# Altium schematic sheet al115v20_power.SchDoc
size A4; DrawnBy: Suraj K A; Engineer: Suraj K A; Organization: Simcons Control Systems; Address1: HMT Colony PO; Address2: Kalamassery; Address3: Cochin; Address4: India
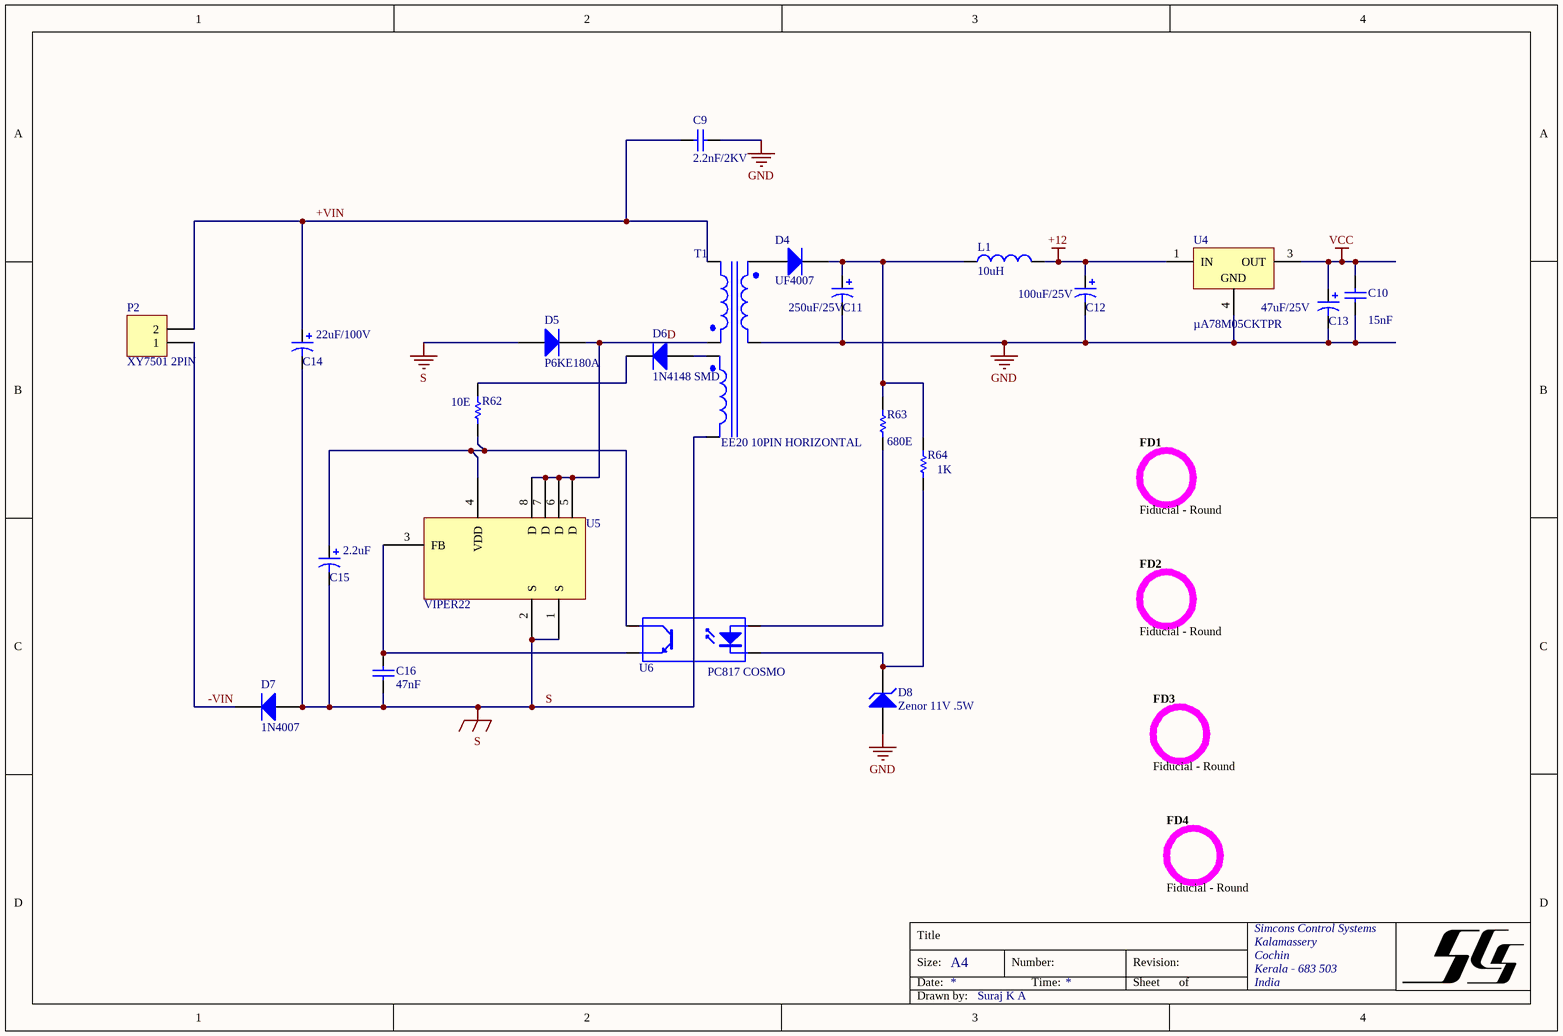
[diagram p0: al115v20_power.SchDoc]

## Parts
C9  2.2nF/2kV  [CAP DISC .2]
C10  value 15nF  [C1206]  (hidden comment: .1uF 1206)
C11  value 250uF/25V  [Cap_.2]  (hidden comment: 470uF/25V)
C12  100uF/25V  [Cap_.6.3x11x2.5]
C13  value 47uF/25V  [Cap_.6.3x11x2.5]  (hidden comment: 100uF/25V)
C14  22uF/100V  [Cap_.2]
C15  value 2.2uF  [Cap_.1]  (hidden comment: 10uF/63V)
C16  value 47nF  [C1206]  (hidden comment: 47nF 1206)
D4  UF4007  [DIODE1A]
D5  P6KE180A  [DIODE1A]
D6  1N4148 SMD  [4148SMDW]
D7  1N4007  [DIODE1A]
D8  Zenor 11V .5W  [DZENOR .25W - duplicate]
FD1  Fiducial - Round  [FIDUCIAL 2mm]
FD2  Fiducial - Round  [FIDUCIAL 2mm]
FD3  Fiducial - Round  [FIDUCIAL 2MM]
FD4  Fiducial - Round  [FIDUCIAL 2MM]
L1  value 10uH  [INDUCTOR 5x8]  (hidden comment: Inductor 10uH Drum Core)
P2  XY7501 2PIN  [XY7501_7.62_2PIN]
R62  value 10E  [R1206]  (hidden comment: 10E 1206)
R63  value 680E  [R1206]  (hidden comment: 100E 1206)
R64  value 1K  [R1206]  (hidden comment: 1K 1206)
T1  EE20 10PIN HORIZONTAL  [EE20_HOR_10PIN]
U4  µA78M05CKTPR  [TO252AA]
U5  VIPER22  [DIP-8_S]
U6  PC817 COSMO  [DIP-4_S]

## Nets
+12: C12.1 L1.2 U4.1(IN)
GND: C9.1 C10.1 C11.2 C12.2 C13.2 D8.1(A) T1.7(Sec1-) U4.4(GND)
S: C14.2 C15.2 C16.2 D5.1(A) D7.1(A) T1.5(Sec2+) U5.1(S) U5.2(S)
VCC: C10.2 C13.1 U4.3(OUT)
+VIN: C9.2 C14.1 P2.2 T1.1(Pri+)
-VIN: D7.2(K) P2.1
D: D5.2(K) T1.2(Pri-) U5.5(D) U5.6(D) U5.7(D) U5.8(D)
NetC11_1: C11.1 D4.2(K) L1.1 R63.2 R64.2
NetC15_1: C15.1 R62.1 U5.4(VDD) U6.4(C)
NetC16_1: C16.1 U5.3(FB) U6.3(E)
NetD4_1: D4.1(A) T1.9(Sec1+)
NetD6_1: D6.1(A) T1.4(Sec2-)
NetD6_2: D6.2(K) R62.2
NetD8_2: D8.2(K) R64.1 U6.2(K)
NetR63_1: R63.1 U6.1(A)

## Notes on the sheet
- Title
- Size:
- Date:
- A4
- Number:
- Time:
- Revision:
- Sheet
- of
- Simcons Control Systems
- Kalamassery
- Cochin
- Kerala - 683 503
- India
- Drawn by:

## Library data of the parts
C9 C10 C16 = Cap: Capacitor; Published: 8-Jun-2000; LatestRevisionDate: 17-Jul-2002; LatestRevisionNote: Re-released for DXP Platform.; PackageReference: RAD-0.3; Publisher: Altium Limited; PackageDescription: Radial Cap, Thru-Hole; 2 Leads; 0.3 in Pin Spacing
  C9: Value: 2.2nF/2KV
C11-C15 = Cap Pol1: Polarized Capacitor (Radial); Published: 8-Jun-2000; LatestRevisionDate: 17-Jul-2002; LatestRevisionNote: Re-released for DXP Platform.; PackageReference: RB7.6-15; Publisher: Altium Limited; PackageDescription: Polarized Capacitor (Radial); 2 Leads
  C12: Value: 100uF/25V
  C14: Value: 22uF/100V
D4-D7 = Diode: Default Diode; Published: 8-Jun-2000; LatestRevisionDate: 17-Jul-2002; LatestRevisionNote: Re-released for DXP Platform.; PackageVersion: Sep-1996; PackageReference: SMC; Publisher: Altium Limited; PackageDescription: DO-214-AB/SMC; 2 C-Bend Leads; Body 7.9 x 5.9 mm, inc. leads (LxW); Code_JEDEC: DO-214-AB
D8 = D Zener: Zener Diode; Published: 8-Jun-2000; LatestRevisionDate: 17-Jul-2002; LatestRevisionNote: Re-released for DXP Platform.; PackageReference: DIODE-0.7; Publisher: Altium Limited; PackageDescription: Diode, Thru-Hole; 2 Leads; 0.7 in Pin Spacing
FD1-FD4 = FIDUCIAL ROUND: Fiducial - Round 1.5mm Top-Bottom; Status: Unreleased; Category: Graphic-PCB
L1 = Inductor: Code_IEC: 1005; Published: 8-Jun-2000; LatestRevisionDate: 29-May-2009; LatestRevisionNote: IPC-7351 Footprint Added.; PackageReference: 0402-A; Publisher: Altium Limited; PackageDescription: Chip Inductor; Code_JEITA: 0402
P2 = Header 2: Header, 2-Pin; LatestRevisionDate: 17-Jul-2002; LatestRevisionNote: Re-released for DXP Platform.; Publisher: Altium Limited
R62 = Res Semi: Semiconductor Resistor; Published: 8-Jun-2000; LatestRevisionDate: 17-Jul-2002; LatestRevisionNote: Re-released for DXP Platform.; PackageReference: AXIAL-0.5; Publisher: Altium Limited; PackageDescription: Axial Device, Thru-Hole; 2 Leads; 0.5 in Pin Spacing
R63 R64 = Res1: Resistor; Published: 8-Jun-2000; LatestRevisionDate: 17-Jul-2002; LatestRevisionNote: Re-released for DXP Platform.; PackageReference: AXIAL-0.3; Publisher: Altium Limited; PackageDescription: Axial Device, Thru-Hole; 2 Leads; 0.3 in Pin Spacing
T1 = TransSwitching: Three-winding Transformer (Switching; Sim Note: Enter the turns ratios, Core loss resistance, Magnetising Reactance, Leakage Reactances and Resistances referred to the primary side into the parameter fields.; Published: 25-Jan-2001; LatestRevisionDate: 17-Jul-2002; LatestRevisionNote: Re-released for DXP Platform.; PackageReference: TRF_6; Publisher: Altium Limited; PackageDescription: Transformer; 6 Leads
U4 = µA78M05CKTPR: Positive-Voltage Regulator; Note: Pin 2 is electrically connected to pin4, and not drawn.; Published: 15-Apr-2002; DatasheetVersion: Jul-1999; PackageVersion: Jan-2001; PackageReference: KTP02; Publisher: Altium Limited; PackageDescription: PowerFLEX (D-PAK/TO-252-AA); 3 Leads (1 Cropped); Body 9.7 (inc. leads) x 6.2 mm (LxW max); Code_JEDEC: TO-252; ComponentLink1Description: Manufacturer Link; ComponentLink1URL: http://www.ti.com/; ComponentLink2Description: Datasheet; ComponentLink2URL: http://www-s.ti.com/sc/ds/ua78m05.pdf
U5 = VIPER22: Manufacturer: Power Integrations; PART NAME: Top Switch II Family
U6 = Optoisolator1: 4-Pin Phototransistor Optocoupler; Published: 24-Mar-1999; LatestRevisionDate: 04-Mar-2005; LatestRevisionNote: Sch pins 3 & 4 Swapped.; DatasheetVersion: Nov-2003; PackageReference: DIP-4; Publisher: Altium Limited